# EAGLE design MotorDriver (EAGLE 5.12)

## Sheet 1 of 4
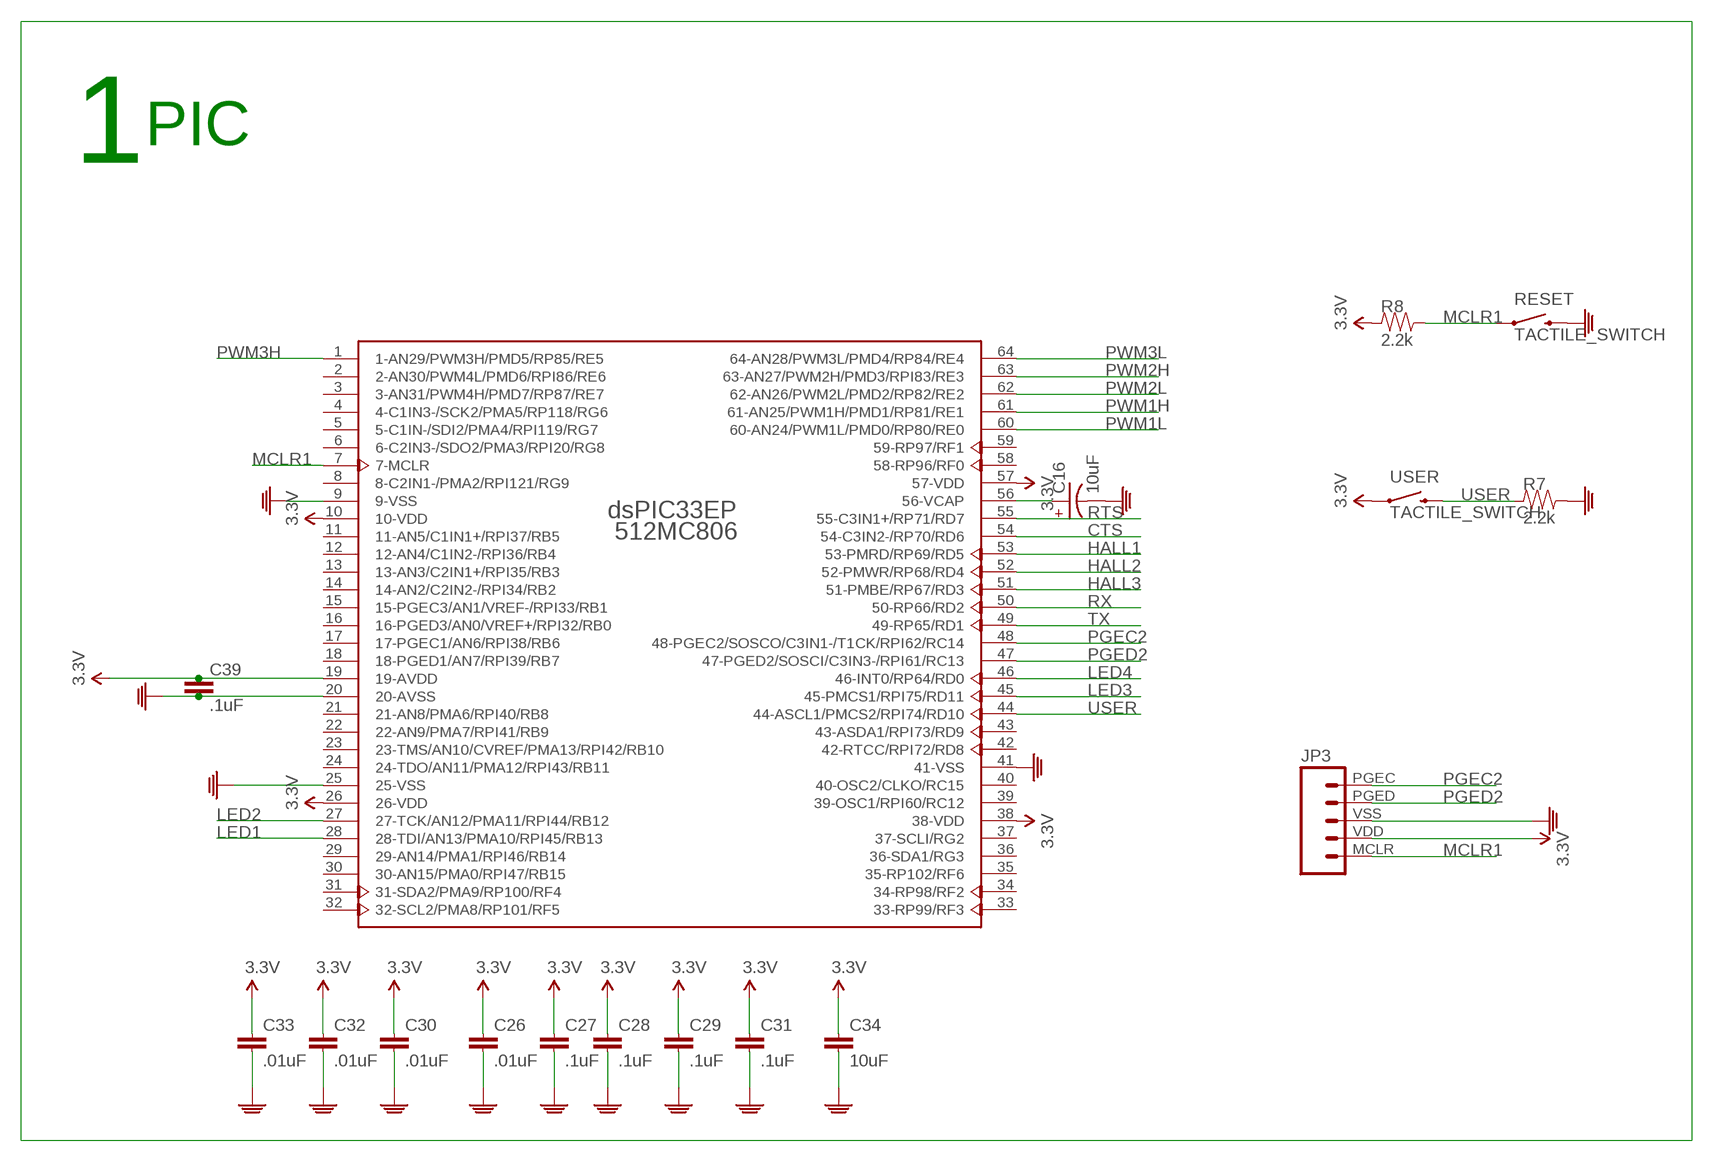
[diagram p0: schematic, sheet 1]

### Parts
C16  10uF  CAP-POL0603  [0603-POL]
C26  .01uF  CAP0603  [0603]
C27  .1uF  CAP0603  [0603]
C28  .1uF  CAP0603  [0603]
C29  .1uF  CAP0603  [0603]
C30  .01uF  CAP0603  [0603]
C31  .1uF  CAP0603  [0603]
C32  .01uF  CAP0603  [0603]
C33  .01uF  CAP0603  [0603]
C34  10uF  CAP1206  [1206]
C39  .1uF  CAP0603  [0603]
JP3  M05PICKIT3  [1X05-PICKIT3]
R7  2.2k  R0603  [0603]
R8  2.2k  R0603  [0603]
RESET  TACTILE_SWITCH  [TACTILE_SWITCH]
U$2  DSPIC33EP512MC806  [TQFP64_10X10]
USER  TACTILE_SWITCH  [TACTILE_SWITCH]

### Nets
3.3V: C26.1 C27.1 C28.1 C29.1 C30.1 C31.1 C32.1 C33.1 C34.1 C39.1 JP3.VDD R8.1 U$2.10(10-VDD) U$2.19(19-AVDD) U$2.26(26-VDD) U$2.38(38-VDD) U$2.57(57-VDD) USER.1 ; also sheet 2,3,4
CTS: U$2.54(54-C3IN2-/RP70/RD6) ; also sheet 4
GND: C16.- C26.2 C27.2 C28.2 C29.2 C30.2 C31.2 C32.2 C33.2 C34.2 C39.2 JP3.VSS R7.2 RESET.2 U$2.9(9-VSS) U$2.20(20-AVSS) U$2.25(25-VSS) U$2.41(41-VSS) ; also sheet 2,3,4
HALL1: U$2.53(53-PMRD/RP69/RD5) ; also sheet 4
HALL2: U$2.52(52-PMWR/RP68/RD4) ; also sheet 4
HALL3: U$2.51(51-PMBE/RP67/RD3) ; also sheet 4
LED1: U$2.28(28-TDI/AN13/PMA10/RPI45/RB13) ; also sheet 4
LED2: U$2.27(27-TCK/AN12/PMA11/RPI44/RB12) ; also sheet 4
LED3: U$2.45(45-PMCS1/RPI75/RD11) ; also sheet 4
LED4: U$2.46(46-INT0/RP64/RD0) ; also sheet 4
MCLR1: JP3.MCLR R8.2 RESET.1 U$2.7(7-MCLR)
N$15: C16.+ U$2.56(56-VCAP)
PGEC2: JP3.PGEC U$2.48(48-PGEC2/SOSCO/C3IN1-/T1CK/RPI62/RC14)
PGED2: JP3.PGED U$2.47(47-PGED2/SOSCI/C3IN3-/RPI61/RC13)
PWM1H: U$2.61(61-AN25/PWM1H/PMD1/RP81/RE1) ; also sheet 2
PWM1L: U$2.60(60-AN24/PWM1L/PMD0/RP80/RE0) ; also sheet 2
PWM2H: U$2.63(63-AN27/PWM2H/PMD3/RPI83/RE3) ; also sheet 2
PWM2L: U$2.62(62-AN26/PWM2L/PMD2/RP82/RE2) ; also sheet 2
PWM3H: U$2.1(1-AN29/PWM3H/PMD5/RP85/RE5) ; also sheet 2
PWM3L: U$2.64(64-AN28/PWM3L/PMD4/RP84/RE4) ; also sheet 2
RTS: U$2.55(55-C3IN1+/RP71/RD7) ; also sheet 4
RX: U$2.50(50-RP66/RD2) ; also sheet 4
TX: U$2.49(49-RP65/RD1) ; also sheet 4
USER: R7.1 U$2.44(44-ASCL1/PMCS2/RPI74/RD10) USER.2
Unconnected: U$2.2(2-AN30/PWM4L/PMD6/RPI86/RE6) U$2.3(3-AN31/PWM4H/PMD7/RP87/RE7) U$2.4(4-C1IN3-/SCK2/PMA5/RP118/RG6) U$2.5(5-C1IN-/SDI2/PMA4/RPI119/RG7) U$2.6(6-C2IN3-/SDO2/PMA3/RPI20/RG8) U$2.8(8-C2IN1-/PMA2/RPI121/RG9) U$2.11(11-AN5/C1IN1+/RPI37/RB5) U$2.12(12-AN4/C1IN2-/RPI36/RB4) U$2.13(13-AN3/C2IN1+/RPI35/RB3) U$2.14(14-AN2/C2IN2-/RPI34/RB2) U$2.15(15-PGEC3/AN1/VREF-/RPI33/RB1) U$2.16(16-PGED3/AN0/VREF+/RPI32/RB0) U$2.17(17-PGEC1/AN6/RPI38/RB6) U$2.18(18-PGED1/AN7/RPI39/RB7) U$2.21(21-AN8/PMA6/RPI40/RB8) U$2.22(22-AN9/PMA7/RPI41/RB9) U$2.23(23-TMS/AN10/CVREF/PMA13/RPI42/RB10) U$2.24(24-TDO/AN11/PMA12/RPI43/RB11) U$2.29(29-AN14/PMA1/RPI46/RB14) U$2.30(30-AN15/PMA0/RPI47/RB15) U$2.31(31-SDA2/PMA9/RP100/RF4) U$2.32(32-SCL2/PMA8/RP101/RF5) U$2.33(33-RP99/RF3) U$2.34(34-RP98/RF2) U$2.35(35-RP102/RF6) U$2.36(36-SDA1/RG3) U$2.37(37-SCLI/RG2) U$2.39(39-OSC1/RPI60/RC12) U$2.40(40-OSC2/CLKO/RC15) U$2.42(42-RTCC/RPI72/RD8) U$2.43(43-ASDA1/RPI73/RD9) U$2.58(58-RP96/RF0) U$2.59(59-RP97/RF1)

### Notes on the sheet
- 1 | PIC

## Sheet 2 of 4
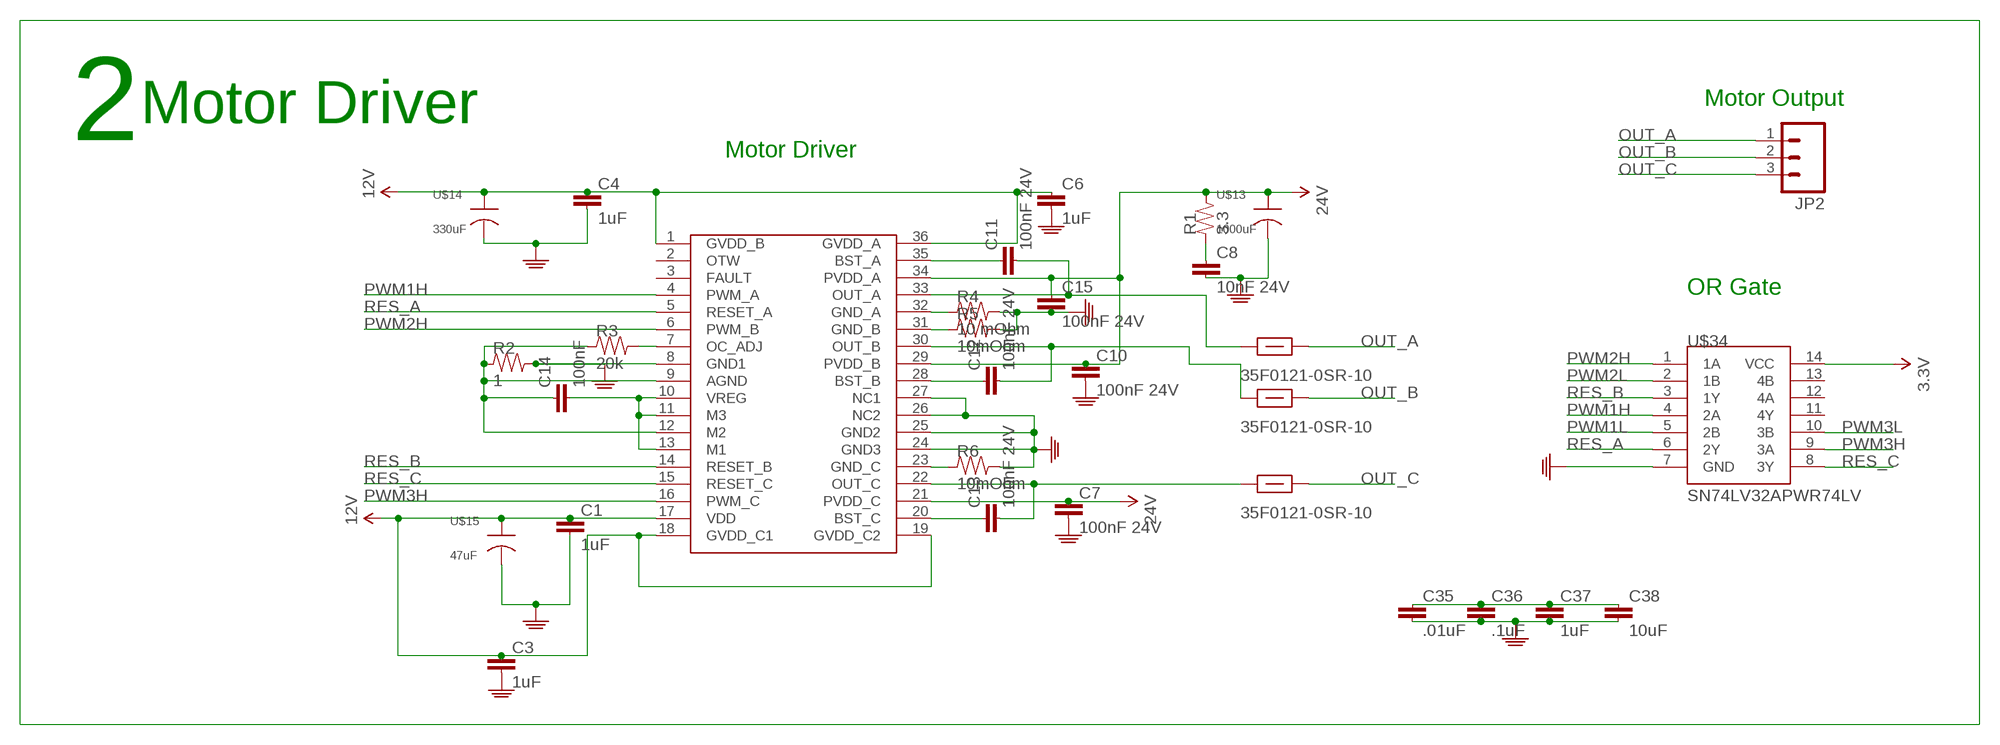
[diagram p1: schematic, sheet 2]

### Parts
C1  1uF  CAP0603  [0603]
C3  1uF  CAP0603  [0603]
C4  1uF  CAP0603  [0603]
C6  1uF  CAP0603  [0603]
C7  100nF 24V  CAP0603  [0603]
C8  10nF 24V  CAP0603  [0603]
C10  100nF 24V  CAP0603  [0603]
C11  100nF 24V  CAP0603  [0603]
C12  100nF 24V  CAP0603  [0603]
C13  100nF 24V  CAP0603  [0603]
C14  100nF  CAP0603  [0603]
C15  100nF 24V  CAP0603  [0603]
C35  .01uF  CAP0603  [0603]
C36  .1uF  CAP0603  [0603]
C37  1uF  CAP1206  [1206]
C38  10uF  CAP1206  [1206]
JP2  M03MINIFITJR  [MOLEX-3-MINIFITJR-RA]
R1  3.3  R0603  [0603]
R2  1  R0603  [0603]
R3  20k  R0603  [0603]
R4  10 mOhm  R0603  [0603]
R5  10mOhm  R0603  [0603]
R6  10mOhm  R0603  [0603]
U$1  DRV833236HSSOP  [36HSSOP]
U$10  35F0121-0SR-10  [2-SMD(J-LEAD)]
U$11  35F0121-0SR-10  [2-SMD(J-LEAD)]
U$12  35F0121-0SR-10  [2-SMD(J-LEAD)]
U$13  1000uF  CAP-RAD  [RADIAL-10]
U$14  330uF  CAP-RAD  [RADIAL-10]
U$15  47uF  CAP-RAD2  [RADIAL-5]
U$34  SN74LV32APWR74LV  [14TSSOP]

### Nets
3.3V: U$34.14(VCC) ; also sheet 1,3,4
12V: C1.1 C3.1 C4.1 C6.1 U$1.1(GVDD_B) U$1.17(VDD) U$1.18(GVDD_C1) U$1.19(GVDD_C2) U$1.36(GVDD_A) U$14.P$2 U$15.P$2 ; also sheet 3
24V: C7.1 C10.1 C15.1 C35.1 C36.1 C37.1 C38.1 R1.2 U$1.21(PVDD_C) U$1.29(PVDD_B) U$1.34(PVDD_A) U$13.P$2 ; also sheet 3
GND: C1.2 C3.2 C4.2 C6.2 C7.2 C8.2 C10.2 C15.2 C35.2 C36.2 C37.2 C38.2 R2.2 R4.2 R5.2 R6.2 U$1.8(GND1) U$1.24(GND3) U$1.25(GND2) U$1.26(NC2) U$1.27(NC1) U$13.P$1 U$14.P$1 U$15.P$1 U$34.7(GND) ; also sheet 1,3,4
M2: C14.1 R2.1 R3.1 U$1.9(AGND) U$1.12(M2)
N$3: R6.1 U$1.23(GND_C)
N$4: C12.2 U$1.30(OUT_B) U$11.P$1
N$5: C8.1 R1.1
N$6: C12.1 U$1.28(BST_B)
N$8: C11.1 U$1.35(BST_A)
N$9: C13.2 U$1.22(OUT_C) U$12.P$1
N$10: C13.1 U$1.20(BST_C)
N$11: C11.2 U$1.33(OUT_A) U$10.P$1
N$12: R3.2 U$1.7(OC_ADJ)
N$13: R4.1 U$1.32(GND_A)
N$14: R5.1 U$1.31(GND_B)
OUT_A: JP2.1 U$10.P$2
OUT_B: JP2.2 U$11.P$2
OUT_C: JP2.3 U$12.P$2
PWM1H: U$1.4(PWM_A) U$34.4(2A) ; also sheet 1
PWM1L: U$34.5(2B) ; also sheet 1
PWM2H: U$1.6(PWM_B) U$34.1(1A) ; also sheet 1
PWM2L: U$34.2(1B) ; also sheet 1
PWM3H: U$1.16(PWM_C) U$34.9(3A) ; also sheet 1
PWM3L: U$34.10(3B) ; also sheet 1
RES_A: U$1.5(RESET_A) U$34.6(2Y)
RES_B: U$1.14(RESET_B) U$34.3(1Y)
RES_C: U$1.15(RESET_C) U$34.8(3Y)
VREG: C14.2 U$1.10(VREG) U$1.11(M3) U$1.13(M1)
Unconnected: U$1.2(OTW) U$1.3(FAULT) U$34.11(4Y) U$34.12(4A) U$34.13(4B)

### Notes on the sheet
- Motor Output
- 2 | Motor Driver
- Motor Driver
- OR Gate

## Sheet 3 of 4
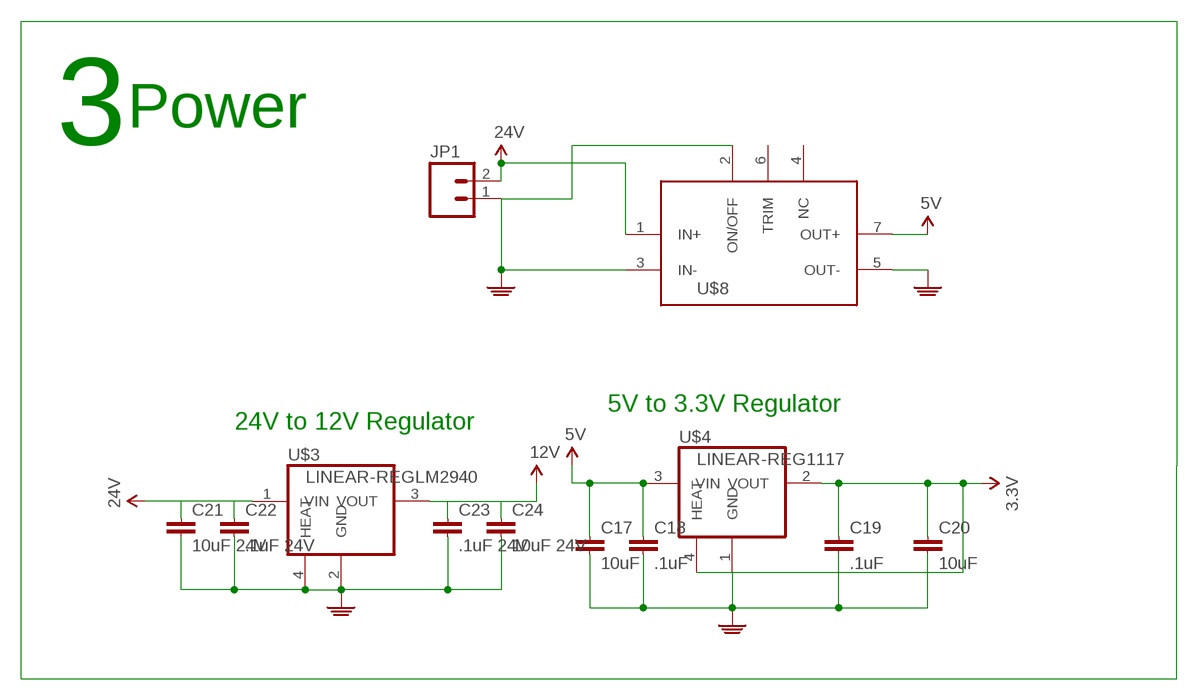
[diagram p2: schematic, sheet 3]

### Parts
C17  10uF  CAP1206  [1206]
C18  .1uF  CAP0603  [0603]
C19  .1uF  CAP0603  [0603]
C20  10uF  CAP1206  [1206]
C21  10uF 24V  CAP1206  [1206]
C22  .1uF 24V  CAP0603  [0603]
C23  .1uF 24V  CAP0603  [0603]
C24  10uF 24V  CAP1206  [1206]
JP1  M02MINI-MATENLOK-2  [TE-MINIMATENLOK-2]
U$3  LINEAR-REGLM2940  LINEAR-REGLM2937  [SOT223]
U$4  LINEAR-REG1117  [SOT223]
U$8  DC-DC-CONVERTER1.2A  [CC6-2405SF-E]

### Nets
3.3V: C19.1 C20.1 U$4.2(VOUT) U$4.4(HEAT) ; also sheet 1,2,4
5V: C17.1 C18.1 U$4.3(VIN) U$8.7(OUT+) ; also sheet 4
12V: C23.1 C24.1 U$3.3(VOUT) ; also sheet 2
24V: C21.1 C22.1 JP1.2 U$3.1(VIN) U$8.1(IN+) ; also sheet 2
GND: C17.2 C18.2 C19.2 C20.2 C21.2 C22.2 C23.2 C24.2 JP1.1 U$3.2(GND) U$3.4(HEAT) U$4.1(GND) U$8.2(ON/OFF) U$8.3(IN-) U$8.5(OUT-) ; also sheet 1,2,4
Unconnected: U$8.4(NC) U$8.6(TRIM)

### Notes on the sheet
- 3 | Power
- 5V to 3.3V Regulator
- 24V to 12V Regulator

## Sheet 4 of 4
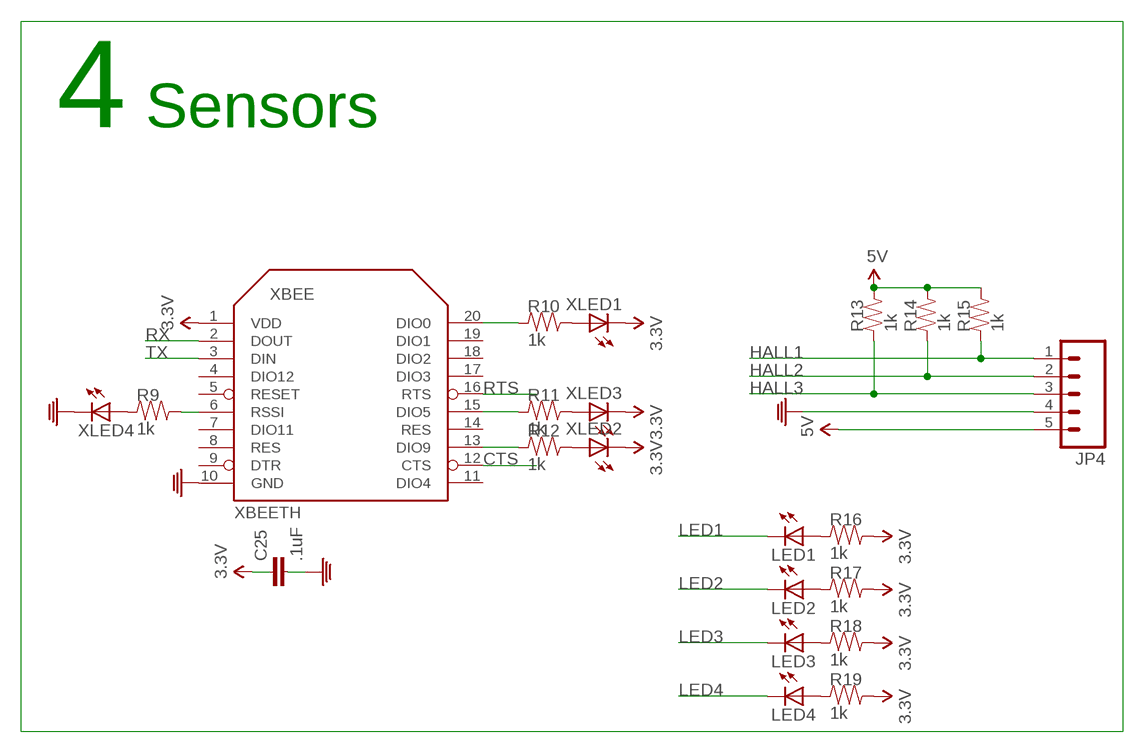
[diagram p3: schematic, sheet 4]

### Parts
C25  .1uF  CAP0603  [0603]
JP4  M05JST-SH  [JST-5-SH]
LED1  LED5MM  [LED5MM]
LED2  LED5MM  [LED5MM]
LED3  LED5MM  [LED5MM]
LED4  LED5MM  [LED5MM]
R9  1k  R0603  [0603]
R10  1k  R0603  [0603]
R11  1k  R0603  [0603]
R12  1k  R0603  [0603]
R13  1k  R0402  [0402]
R14  1k  R0402  [0402]
R15  1k  R0402  [0402]
R16  1k  R0603  [0603]
R17  1k  R0603  [0603]
R18  1k  R0603  [0603]
R19  1k  R0603  [0603]
XBEE  XBEETH  [XBEE-SILK]
XLED1  LED0603  [0603-DIODE]
XLED2  LED0603  [0603-DIODE]
XLED3  LED0603  [0603-DIODE]
XLED4  LED0603  [0603-DIODE]

### Nets
3.3V: C25.1 R16.2 R17.2 R18.2 R19.2 XBEE.1(VDD) XLED1.CAT(C) XLED2.CAT(C) XLED3.CAT(C) ; also sheet 1,2,3
5V: JP4.5 R13.2 R14.2 R15.2 ; also sheet 3
CTS: XBEE.12(CTS) ; also sheet 1
GND: C25.2 JP4.4 XBEE.10(GND) XLED4.CAT(C) ; also sheet 1,2,3
HALL1: JP4.1 R15.1 ; also sheet 1
HALL2: JP4.2 R14.1 ; also sheet 1
HALL3: JP4.3 R13.1 ; also sheet 1
LED1: LED1.K(C) ; also sheet 1
LED2: LED2.K(C) ; also sheet 1
LED3: LED3.K(C) ; also sheet 1
LED4: LED4.K(C) ; also sheet 1
N$20: R9.1 XLED4.AN(A)
N$21: R10.2 XLED1.AN(A)
N$22: R11.2 XLED3.AN(A)
N$23: R12.2 XLED2.AN(A)
N$24: R9.2 XBEE.6(RSSI)
N$25: R10.1 XBEE.20(DIO0)
N$26: R11.1 XBEE.15(DIO5)
N$27: R12.1 XBEE.13(DIO9)
N$29: LED1.A R16.1
N$31: LED2.A R17.1
N$32: LED3.A R18.1
N$33: LED4.A R19.1
RTS: XBEE.16(RTS) ; also sheet 1
RX: XBEE.2(DOUT) ; also sheet 1
TX: XBEE.3(DIN) ; also sheet 1
Unconnected: XBEE.4(DIO12) XBEE.5(RESET) XBEE.7(DIO11) XBEE.8(RES) XBEE.9(DTR) XBEE.11(DIO4) XBEE.14(RES) XBEE.17(DIO3) XBEE.18(DIO2) XBEE.19(DIO1)

### Notes on the sheet
- 4 | Sensors

## Library data of the parts
C1 C3 C4 C6-C8 C10-C15 C17-C39 = GibbotV5:CAP: Capacitor Standard 0603 ceramic capacitor, and 0.1" leaded capacitor.
C16 = GibbotV5:CAP-POL: CAPACITOR, American symbol
JP1 = GibbotV5:M02: Header 2 Standard 2-pin 0.1" header. Use with straight break away headers (SKU : PRT-00116), right angle break away headers (PRT-00553), swiss pins (PRT-00743), machine pins (PRT-00117), and female headers (PRT-00115). Molex polarized connector foot print use with SKU : PRT-08233 with associated crimp pins and housings.
JP2 = GibbotV5:M03: Header 3 Standard 3-pin 0.1" header. Use with straight break away headers (SKU : PRT-00116), right angle break away headers (PRT-00553), swiss pins (PRT-00743), machine pins (PRT-00117), and female headers (PRT-00115). Molex polarized connector foot print use with SKU : PRT-08232 with associated crimp pins and housings.
JP3 JP4 = GibbotV5:M05: Header 5 Standard 5-pin 0.1" header. Use with straight break away headers (SKU : PRT-00116), right angle break away headers (PRT-00553), swiss pins (PRT-00743), machine pins (PRT-00117), and female headers (PRT-00115). Molex polarized connector foot print use with SKU : PRT-08230 with associated crimp pins and housings.
LED1-LED4 XLED1-XLED4 = GibbotV5:LED: LEDs Standard schematic elements and footprints for 5mm, 3mm, 1206, and 0603 sized LEDs. 5mm - Spark Fun Electronics SKU : COM-00529 (and others)
R1-R19 = GibbotV5:R: RESISTOR, American symbol
RESET USER = GibbotV5:TACTILE_SWITCH
U$1 = motordriver:DRV8332
U$2 = GibbotV5:DSPIC33EP512MC806
U$3 U$4 = GibbotV5:LINEAR-REG
U$8 = GibbotV5:DC-DC-CONVERTER
U$10-U$12 = motordriver:35F0121-0SR-10
U$13 U$14 = motordriver:CAP-RAD
U$15 = motordriver:CAP-RAD2
U$34 = motordriver:SN74LV32APWR
XBEE = GibbotV5:XBEE

## Board
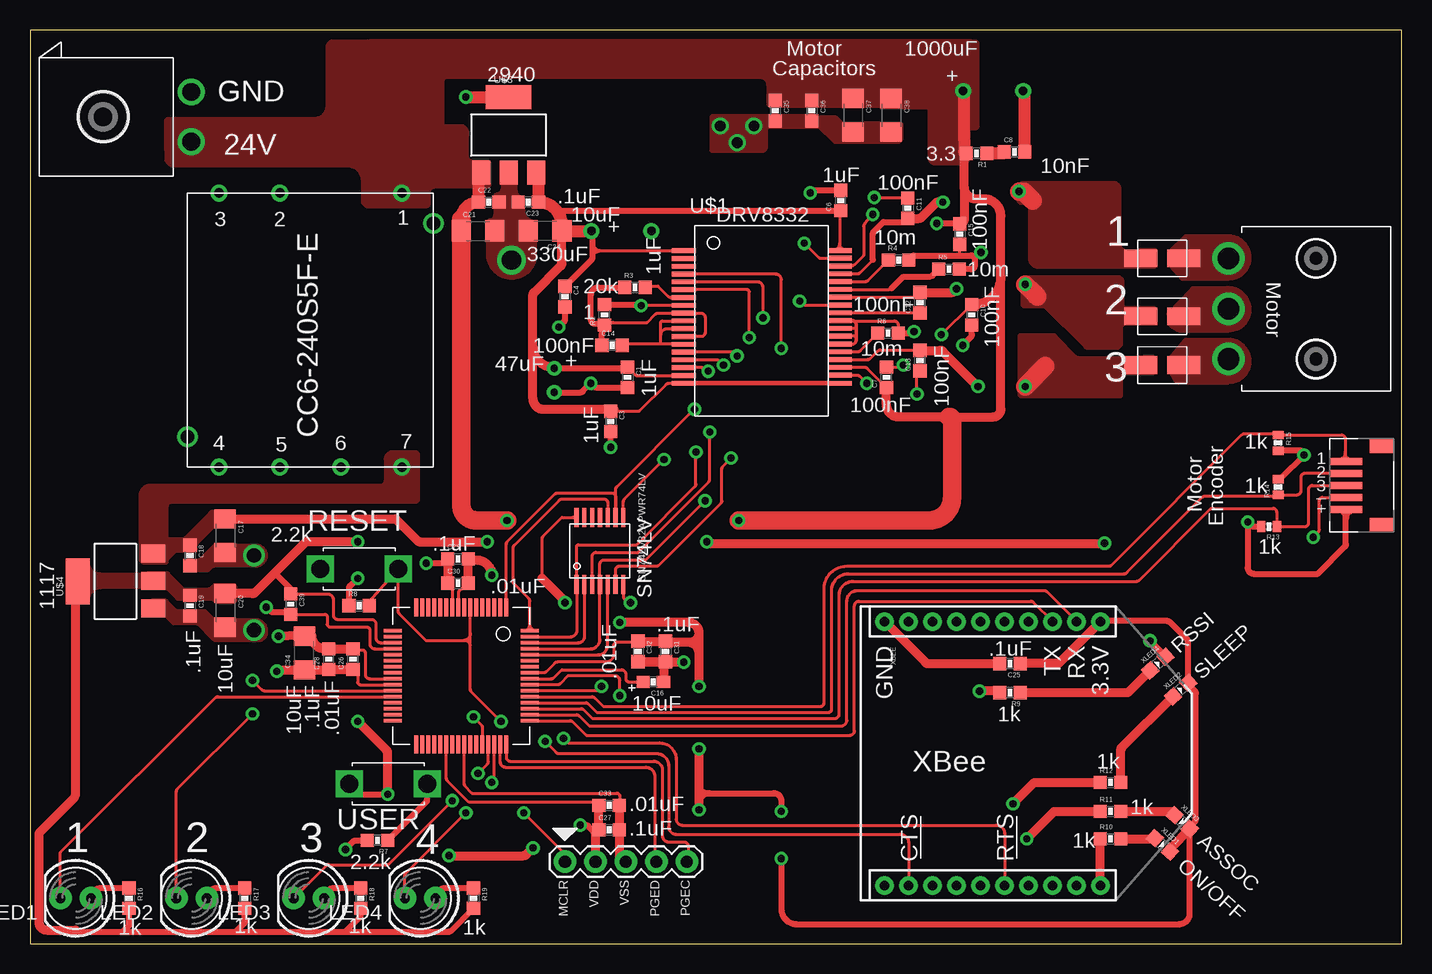
[diagram p4: board, top side]
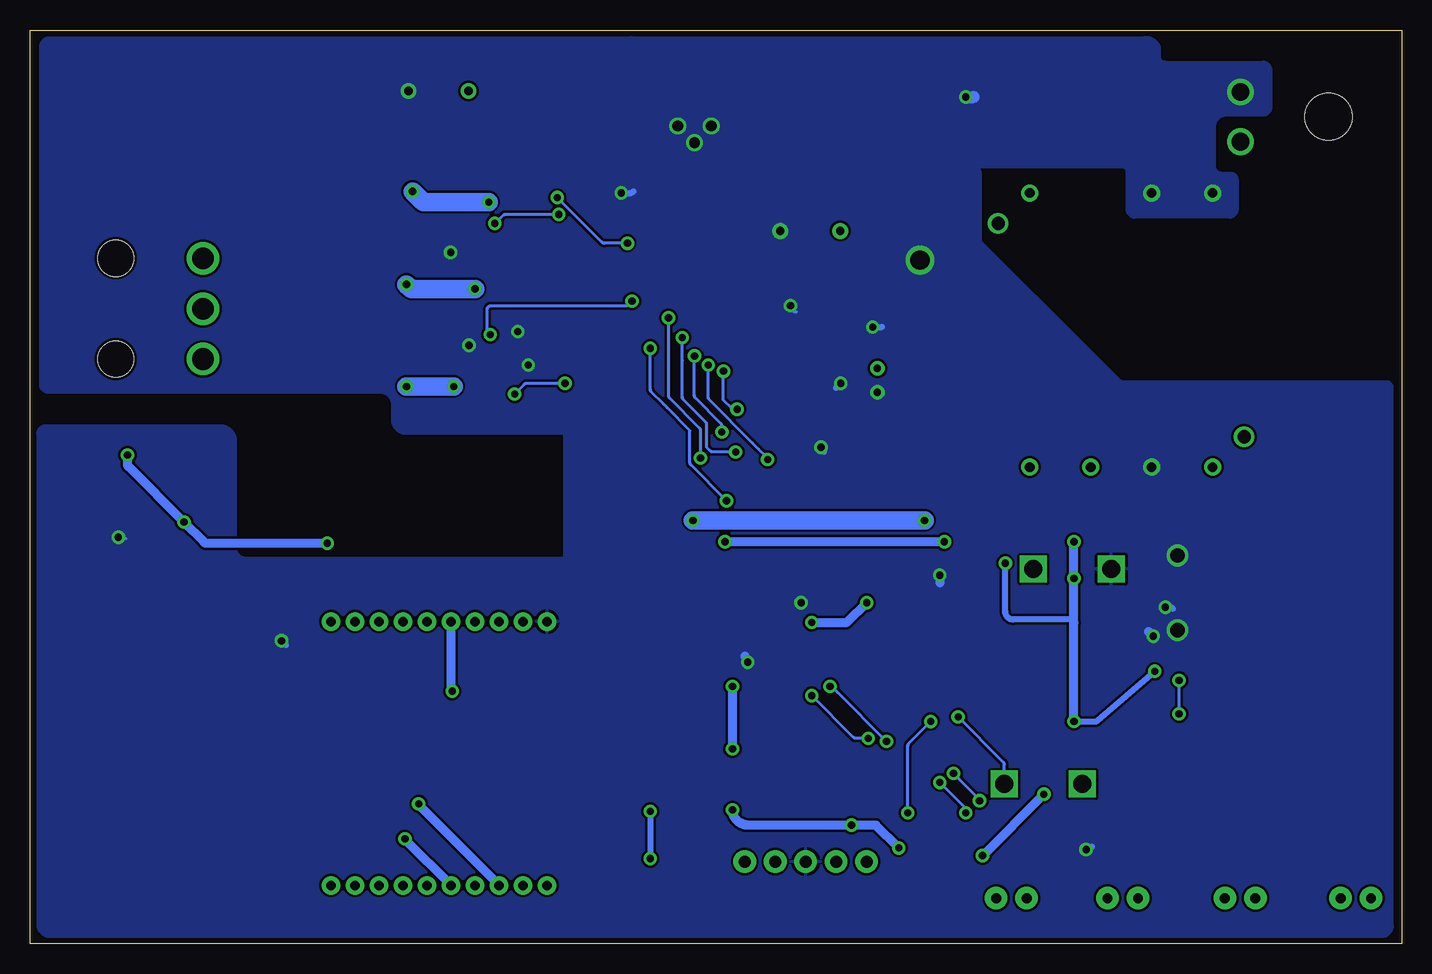
[diagram p5: board, bottom side, seen from below]

Size 114.3 x 76.2 mm. Coordinates in mm from the lower left corner, seen from the top.
Outline: 0,0 114.3,0 114.3,76.2 0,76.2 0,0
Copper layers (1*16): Top 0.035mm / dielectric 1.5mm / Bottom 0.035mm
Design rules "default *": minimum track width 8mil, minimum drill 20mil, track to track 8mil, track to pad 8mil, pad to pad 5mil, via to via 8mil, smd to smd 5mil, copper to edge 10mil, drill to drill 8mil, minimum pad ring 12mil, minimum via ring 10mil, stop-mask expansion 4mil, vias tented up to drill 0mil, thermal gap 10mil

### Footprints (pad centres in the part's own frame; a part is rotated, then mirrored left to right if it is on the bottom)
0603 = smd 1.1 x 1.1: 1 -0.85,0; 2 0.85,0
0603-POL = smd 1.1 x 1: + 0.85,0; - -0.85,0
1206 = smd 1.6 x 1.8: 1 -1.4,0; 2 1.4,0
TE-MINIMATENLOK-2 = drill 1.48 round: 1 -2.07,12.67; 2 2.07,12.67 | hole 3.91: 0,5.33
MOLEX-3-MINIFITJR-RA = drill 1.803 round: 1 4.191,13.538; 2 0,13.538; 3 -4.191,13.538 | hole 3: -4.204,6.248; 4.204,6.248
1X05-PICKIT3 = drill 1.016 pad 1.88 round: MCLR 1.27,-1.016; PGEC 11.43,-1.016; PGED 8.89,-1.016; VDD 3.81,-1.016; VSS 6.35,-1.016
JST-5-SH = smd 0.6 x 2.7: 1 2,4; 2 1,4; 3 0,4; 4 -1,4; 5 -2,4 | smd 1.2 x 2: P$6 -3.3,1; P$7 3.3,1
LED5MM = drill 0.813 pad 1.88 round: A -1.27,0; K 1.27,0
0402 = smd 0.7 x 0.9: 1 -0.65,0; 2 0.65,0
TACTILE_SWITCH = drill 1.5 square: 1 -3.25,0; 2 3.25,0
36HSSOP = smd 2 x 0.4: 1 -6.5,5.85; 2 -6.5,5.2; 3 -6.5,4.55; 4 -6.5,3.9; 5 -6.5,3.25; 6 -6.5,2.6; 7 -6.5,1.95; 8 -6.5,1.3; 9 -6.5,0.65; 10 -6.5,0; 11 -6.5,-0.65; 12 -6.5,-1.3; 13 -6.5,-1.95; 14 -6.5,-2.6; 15 -6.5,-3.25; 16 -6.5,-3.9; 17 -6.5,-4.55; 18 -6.5,-5.2; 19 6.5,-5.2; 20 6.5,-4.52; 21 6.5,-3.87; 22 6.5,-3.22; 23 6.5,-2.57; 24 6.5,-1.92; 25 6.5,-1.27; 26 6.5,-0.62; 27 6.5,0.03; 28 6.5,0.68; 29 6.5,1.33; 30 6.5,1.98; 31 6.5,2.63; 32 6.5,3.28; 33 6.5,3.93; 34 6.5,4.58; 35 6.5,5.23; 36 6.5,5.85
TQFP64_10X10 = smd 1.5 x 0.3: 1 -5.7,3.75; 2 -5.7,3.25; 3 -5.7,2.75; 4 -5.7,2.25; 5 -5.7,1.75; 6 -5.7,1.25; 7 -5.7,0.75; 8 -5.7,0.25; 9 -5.7,-0.25; 10 -5.7,-0.75; 11 -5.7,-1.25; 12 -5.7,-1.75; 13 -5.7,-2.25; 14 -5.7,-2.75; 15 -5.7,-3.25; 16 -5.7,-3.75; 33 5.7,-3.75; 34 5.7,-3.25; 35 5.7,-2.75; 36 5.7,-2.25; 37 5.7,-1.75; 38 5.7,-1.25; 39 5.7,-0.75; 40 5.7,-0.25; 41 5.7,0.25; 42 5.7,0.75; 43 5.7,1.25; 44 5.7,1.75; 45 5.7,2.25; 46 5.7,2.75; 47 5.7,3.25; 48 5.7,3.75 | smd 0.3 x 1.5: 17 -3.75,-5.7; 18 -3.25,-5.7; 19 -2.75,-5.7; 20 -2.25,-5.7; 21 -1.75,-5.7; 22 -1.25,-5.7; 23 -0.75,-5.7; 24 -0.25,-5.7; 25 0.25,-5.7; 26 0.75,-5.7; 27 1.25,-5.7; 28 1.75,-5.7; 29 2.25,-5.7; 30 2.75,-5.7; 31 3.25,-5.7; 32 3.75,-5.7; 49 3.75,5.7; 50 3.25,5.7; 51 2.75,5.7; 52 2.25,5.7; 53 1.75,5.7; 54 1.25,5.7; 55 0.75,5.7; 56 0.25,5.7; 57 -0.25,5.7; 58 -0.75,5.7; 59 -1.25,5.7; 60 -1.75,5.7; 61 -2.25,5.7; 62 -2.75,5.7; 63 -3.25,5.7; 64 -3.75,5.7
SOT223 = smd 1.499 x 2.007: 1 -2.261,-3.15; 2 0.025,-3.15; 3 2.311,-3.15 | smd 3.81 x 2.007: 4 0,3.15
CC6-2405SF-E = drill 0.8 round: 1 -11.43,7.62; 2 -11.43,-2.54; 3 -11.43,-7.62; 4 11.43,-7.62; 5 11.43,-2.54; 6 11.43,2.54; 7 11.43,7.62 | drill 1.1 round: P$9 8.89,-10.25; P$10 -8.89,10.25
2-SMD(J-LEAD) = smd 2.77 x 1.47: P$1 -1.79,0; P$2 1.79,0
RADIAL-10 = drill 0.7 round: P$1 0,2.5; P$2 0,-2.5
RADIAL-5 = drill 0.6 round: P$1 0,1; P$2 0,-1
14TSSOP = smd 1.6 x 0.35: 1 -2.8,1.95; 2 -2.8,1.3; 3 -2.8,0.65; 4 -2.8,0; 5 -2.8,-0.65; 6 -2.8,-1.3; 7 -2.8,-1.95; 8 2.8,-1.95; 9 2.8,-1.3; 10 2.8,-0.65; 11 2.8,0; 12 2.8,0.65; 13 2.8,1.3; 14 2.8,1.95
XBEE-SILK = drill 0.8 pad 1.524 round: 1 -11,20; 2 -11,18; 3 -11,16; 4 -11,14; 5 -11,12; 6 -11,10; 7 -11,8; 8 -11,6; 9 -11,4; 10 -11,2; 11 11,2; 12 11,4; 13 11,6; 14 11,8; 15 11,10; 16 11,12; 17 11,14; 18 11,16; 19 11,18; 20 11,20
0603-DIODE = smd 1.1 x 1.1: AN -0.85,0; CAT 0.85,0

### Placement (x,y rotation side)
C1  49.78,47.24 270 top
C3  48.39,43.56 270 top
C4  44.58,53.98 270 top
C6  67.56,61.98 90 top
C7  71.37,47.24 90 top
C8  82.04,66.04 0 top
C10  78.49,52.45 270 top
C11  73.15,61.34 270 top
C12  74.17,53.47 90 top
C13  74.17,48.64 90 top
C14  48.51,49.91 0 top
C15  77.47,59.18 270 top
C16  51.94,21.84 180 top
C17  16.26,34.04 270 top
C18  13.34,32.38 270 top
C19  13.34,28.19 270 top
C20  16.26,27.81 270 top
C21  37.34,59.44 0 top
C22  38.23,61.85 0 top
C23  41.53,61.85 180 top
C24  42.93,59.44 180 top
C25  81.66,23.37 180 top
C26  26.92,23.75 90 top
C27  48.26,9.53 0 top
C28  24.89,23.75 90 top
C29  35.66,32.11 0 top
C30  35.66,30.07 0 top
C31  52.96,24.38 270 top
C32  50.67,24.38 270 top
C33  48.26,11.56 0 top
C34  22.86,24.26 90 top
C35  62.1,69.47 270 top
C36  65.15,69.47 270 top
C37  68.58,69.09 270 top
C38  71.75,69.09 270 top
C39  21.72,28.32 270 top
JP1  0.76,68.96 270 top
JP2  113.41,52.96 90 top
JP3  43.31,7.87 0 top
JP4  113.67,38.23 90 top
LED1  3.81,3.81 180 top
LED2  13.46,3.81 180 top
LED3  23.24,3.81 180 top
LED4  32.51,3.81 180 top
R1  78.87,65.91 180 top
R2  47.88,52.45 90 top
R3  50.42,54.74 0 top
R4  72.39,57.02 0 top
R5  76.58,56.26 0 top
R6  71.5,50.93 0 top
R7  28.96,8.64 180 top
R8  27.43,28.19 0 top
R9  81.66,20.95 180 top
R10  90.04,8.76 0 top
R11  90.04,11.05 0 top
R12  90.04,13.46 0 top
R13  103.25,34.8 180 top
R14  104.01,38.1 90 top
R15  104.01,41.78 270 top
R16  8.26,3.81 270 top
R17  17.91,3.81 270 top
R18  27.56,3.81 270 top
R19  36.96,3.81 270 top
RESET  27.43,31.24 180 top
U$1  60.96,51.94 0 top
U$2  35.94,22.35 270 top
U$3  39.88,67.44 0 top
U$4  7.11,30.23 90 top
U$8  23.37,51.18 270 top
U$10  94.36,57.15 0 top
U$11  94.36,52.32 0 top
U$12  94.36,48.26 0 top
U$13  80.26,71.12 270 top
U$14  49.28,59.44 270 top
U$15  43.69,46.99 180 top
U$34  47.5,32.77 90 top
USER  29.84,13.34 0 top
XBEE  69.22,15.88 270 top
XLED1  94.36,8.26 318 top
XLED2  95.89,21.21 42 top
XLED3  96.01,10.16 318 top
XLED4  93.98,23.37 42 top

### Tracks (layer width: path | path; a pad name or v marks a point on that pad's centre or on a via)
3.3V  (via drill 0.6)
  Top 0.254: U$2.38 34.69,13.83 arc45 34.78,13.6 36.58,11.81 47.02,11.81 arc-45 47.25,11.72 C33.1 | U$2.10 35.19,30.12 arc45 35.1,30.35 C30.1 | 42.67,30.48 42.67,33.78 arc-45 42.77,34 44.32,35.56 45.23,35.56 arc-90 45.54,35.17 U$34.14 arc-90 U$34.14 | U$34.14 arc-45 45.53,35.56 | 45.26,35.56 arc90 45.53,36.03 45.53,35.58 arc90 U$34.14 | 3.84,1.11 arc-45 4.07,1.02 | U$2.57 42.79,22.6 arc45 43.02,22.7 43.72,23.4 arc-45 43.95,23.5 48.01,23.5 arc90 48.64,24.13 48.64,24.89 arc-90 48.9,25.15 50.55,25.15 | 50.55,25.15 50.59,25.15 arc90 C32.1 | 50.55,25.15 arc90 50.67,25.27 52.83,25.27 arc-90 52.96,25.15 | U$2.26 27.55,21.6 arc-90 27.3,21.84 27.3,22.52 arc90 C26.1 | U$2.19 29.25,25.1 arc-90 28.83,25.53 28.83,26.67 arc90 28.45,27.05 25.65,27.05 arc-90 25.27,27.43 25.27,28.7 arc90 24.8,29.17 C39.1 arc90 21.93,28.96
  Top 0.406: 3.72,12.23 arc90 3.81,12.32 3.81,12.45
  Top 0.508: R19.2 35.11,1.11 arc-45 34.88,1.02 26.29,1.02 | 7.75,1.02 17.14,1.02 | 17.14,1.02 26.29,1.02 | R18.2 27.56,2.42 arc-45 27.47,2.19 26.29,1.02 | R17.2 17.91,1.91 arc-45 17.81,1.69 17.14,1.02 | R16.2 8.26,1.66 arc-45 8.16,1.43 7.75,1.02 | 4.07,1.02 7.75,1.02 | 3.81,1.14 3.84,1.11 | R8.1 26.58,29.62 arc-45 26.68,29.85 v27.3,30.48 | v62.61,7.11 62.61,2.92 arc90 63.88,1.65 95.76,1.65 arc90 96.64,2.54 XLED3.CAT 96.64,9.64 arc-45 96.74,9.87 97.06,10.19 arc45 97.16,10.42 97.16,20.88 arc45 97.06,21.1 96.64,21.52 arc45 96.55,21.74 XLED2.CAT 96.52,25.14 arc45 96.42,25.37 94.96,26.83 arc45 94.74,26.92 89.33,26.92 arc45 XBEE.1 | 47.12,9.23 46.54,9.81 arc45 46.31,9.91 v45.85,9.91 | v62.61,11.05 62.61,11.94 arc90 61.98,12.57 56.64,12.57 arc90 55.75,11.68 | 55.75,13.21 arc90 56.39,12.57 | v33.02,31.75 34.58,31.75 arc90 C29.1 | v29.81,12.48 27.58,12.48 arc-45 27.36,12.57 USER.1 | 21.93,28.96 21.93,29.24 arc45 21.84,29.47 20.38,30.92
  Top 0.762: JP3.VDD 47.12,9.23 arc-90 C27.1 C33.1 | XLED1.CAT 94.99,7.81 arc-45 95.09,8.03 XLED3.CAT | C25.1 85.58,23.37 arc45 85.8,23.46 XBEE.1 | C29.1 C30.1 | U$4.4 arc90 3.81,30.07 3.81,12.45 | C20.1 18.54,29.21 arc45 18.77,29.31 20.38,30.92 22.99,33.53 v27.3,33.53 | 55.75,24.26 v55.75,21.46 55.75,21.34 | 55.75,24.26 55.75,25.91 | 55.75,25.91 arc90 54.86,26.8 v49.15,26.8 | 3.72,12.23 0.85,9.36 arc45 0.76,9.14 0.76,1.78 arc90 1.4,1.14 3.81,1.14 | C26.1 C28.1 arc-90 24.85,22.86 C34.1 20.7,22.86 arc90 v20.57,22.73 | v55.75,11.18 55.75,11.68 55.75,13.21 v55.75,16.26 | v44.58,28.45 arc45 44.49,28.66 42.67,30.48 | v34.92,7.37 41.14,7.37 arc45 41.37,7.46 v41.91,8 | v27.3,18.55 29.72,16.13 arc-45 29.81,15.91 v29.81,12.48 | C32.1 C31.1 | 55.75,25.91 arc-90 54.99,25.15 | 52.96,25.15 54.86,25.15 arc-90 55.75,24.26
  Bottom 0.508: v33.02,31.75 33.02,27.69 arc-90 32.38,27.05 27.56,27.05 arc90 27.3,26.8 | v27.3,18.55 25.53,18.55 arc-45 25.3,18.64 v20.57,22.73 | v62.61,11.05 v62.61,7.11
  Bottom 0.762: v27.3,18.55 27.3,26.8 v27.3,30.48 v27.3,33.53 | v55.75,11.18 arc-90 54.48,9.91 v45.85,9.91 43.81,9.91 v41.91,8 | v55.75,16.26 v55.75,21.46 | v49.15,26.8 46.36,26.8 arc-45 46.13,26.89 v44.58,28.45 | v29.81,12.48 v34.92,7.37
  pour Top (no thermals): 3.56,31.88 4.83,31.88 arc90 5.84,30.86 9.4,30.86 10.79,30.86 arc-90 11.05,30.61 11.05,29.97 arc-90 10.79,29.72 5.97,29.72 arc90 4.83,28.57 3.43,28.57 arc90 3.3,28.45
  pour Top (no thermals): 10.29,30.99 11.3,30.99 arc-45 11.52,30.89 12.83,29.59 14.85,29.59 arc45 15.08,29.68 15.37,29.97 16.89,29.97 arc-90 17.14,29.72 17.14,28.7 arc-90 16.89,28.45 15.63,28.45 arc-45 15.4,28.54 15.24,28.7 12.45,28.7 arc-45 12.23,28.8 11.43,29.59 9.91,29.59 arc-90 9.78,29.72 9.78,30.86 arc-90 9.91,30.99
5V  (via drill 0.6)
  Top 0.508: R15.2 105.81,41.13 arc-90 v106.17,40.77 104.25,38.84 arc-45 104.02,38.75 R14.2 | R13.2 101.99,34.8 arc-45 101.76,34.89 v101.47,35.18 | v101.47,35.18 arc90 101.35,35.05 | v101.47,35.18 101.47,31.37 arc90 101.98,30.86 107.31,30.86 109.57,33.12 arc45 109.67,33.34 109.67,35.5 arc-90 110.36,36.2 109.09,36.2 | 109.09,36.2 108.97,36.2 | 109.09,36.2 arc-90 109.67,35.43 JP4.5 | JP4.5 arc-90 JP4.5
  Top 0.762: C17.1 30.47,35.44 32.29,33.62 arc45 32.51,33.53 v38.1,33.53 | v89.53,33.4 56.65,33.4 arc-45 56.42,33.49 v56.39,33.53
  Bottom 0.762: v106.17,40.77 106.17,40.01 arc-45 106.08,39.78 v101.47,35.18 99.79,33.49 arc-45 99.56,33.4 v89.53,33.4 | v38.1,33.53 v56.39,33.53
  pour Top (no thermals): 10.41,31.75 11.04,31.75 arc45 11.27,31.84 12.19,32.77 13.84,32.77 13.84,33.14 arc-45 13.94,33.37 15.37,34.8 16.89,34.8 arc90 17.02,34.92 17.02,35.94 arc90 16.89,36.07 15.37,36.07 15.24,36.07 arc45 15.02,35.98 12.83,33.78 11.18,33.78 arc45 10.96,33.69 10.29,33.02
  pour Top (no thermals): 30.86,41.02 30.23,41.02 arc90 29.59,40.39 29.59,38.61 arc-90 29.21,38.23 10.03,38.23 arc90 9.14,37.34 9.14,32.13 arc90 9.53,31.75 11.3,31.75 arc90 11.43,31.88 11.43,36.45 arc-90 11.81,36.83 32.13,36.83 arc90 32.38,37.08 32.38,40.77 arc90 32.13,41.02
12V
  Top 0.254: U$1.17 50.62,47.39 arc-45 50.39,47.49 C1.1 | U$1.18 53.22,46.74 arc45 53,46.65 50.85,44.5 arc-45 50.63,44.41 C3.1 48.46,44.48 arc-45 48.68,44.58 | C6.1 67.55,61.12 arc45 67.46,60.89 67.46,58.29 | 67.46,58.29 arc-90 66.79,57.84 68.1,57.84 | 68.1,57.84 68.28,57.84 | 68.1,57.84 arc-90 67.46,58.39 | 67.46,58.29 U$1.36 | 43.56,61.47 42.76,61.47 arc-90 C23.1 | 46.87,58.55 arc90 47.62,57.79 | U$1.1 47.55,57.79 arc90 46.77,57.02
  Top 0.381: U$1.18 U$1.19
  Top 0.508: C6.1 44.03,61.13 arc-45 43.81,61.22 43.56,61.47 | 46.87,59.44 46.87,58.55 46.87,57.24 arc-45 46.77,57.02 C4.1 | 43.6,48.09 43.68,48.02 | 43.68,48.02 49.6,48.02 arc45 C1.1 | 43.68,48.02 arc-45 U$15.P$2
  Top 0.762: 41.91,49.78 arc90 43.6,48.09 | 41.91,49.78 41.91,54.1 arc-45 42,54.32 44.23,56.55 arc45 44.33,56.78 C24.1 | 48.68,44.58 42.8,44.58 arc-90 41.91,45.47 41.91,49.78
  Top 1.016: U$3.3 arc-90 42.38,64.1 C23.1 arc-90 44.33,59.9 C24.1 U$14.P$2 46.87,59.44
24V  (via drill 0.6)
  Top 0.254: U$1.21 69.56,48.07 arc-45 69.79,47.98 C7.1 | U$1.29 64.59,53.27 arc-45 64.36,53.37 v64.14,53.59 | U$1.34 68.46,56.52 arc45 68.68,56.62 69.47,57.4 69.47,59.81 arc-45 69.56,60.04 v70.23,60.83 | C15.1 arc45 77.38,60.07 | C10.1 arc45 78.42,53.27 v75.95,50.8
  Top 0.508: 77.38,60.07 v75.56,60.07
  Top 0.762: C10.1 78.57,53.3 arc90 80.9,55.63 | C15.1 arc90 77.85,60.41 77.85,63.12 | C7.1 71.37,44.96 arc90 72.39,43.94 76.58,43.94 80.26,43.94 arc90 80.9,44.58 80.9,55.63 | 80.9,60.71 arc90 79.5,62.1 | 78.87,62.1 arc-90 77.85,63.12 | 77.85,63.12 77.85,67.06 | 78.87,62.1 arc-90 77.85,63.12 | 79.5,62.1 78.87,62.1 | 80.9,60.71 arc90 79.5,62.1 | 80.9,55.63 80.9,60.71
  Top 1.016: C21.1 35.94,60.41 arc-90 C22.1 37.38,64.05 arc-90 U$3.1 | R1.2 arc-90 77.85,66.08 77.85,67.06 77.85,71.12 arc90 77.72,71.25
  Top 1.524: 35.94,60.41 35.94,36.58 arc90 37.21,35.31 v39.75,35.31 | v59.05,35.31 74.93,35.31 arc90 76.83,37.21 76.83,43.69 arc90 76.58,43.94
  Bottom 0.254: v64.14,53.59 64.42,53.31 arc45 64.65,53.21 75.88,53.21 arc-90 76.2,52.9 76.2,51.19 arc-45 76.11,50.96 v75.95,50.8 | v70.23,60.83 74.67,60.83 arc-45 74.9,60.74 v75.56,60.07
  Bottom 1.524: v39.75,35.31 v59.05,35.31
  pour Top (no thermals): 36.07,68.2 12.06,68.2 arc90 11.3,67.44 11.3,65.53 arc90 11.94,64.9 26.42,64.9 arc-90 27.69,63.63 27.69,61.98 arc90 28.19,61.47 33.02,61.47 arc90 33.27,61.72 33.27,62.61 arc-90 33.78,63.12 38.1,63.12 arc90 38.35,63.37 38.35,65.02 arc90 38.1,65.28 36.83,65.28 arc-90 36.45,65.66 36.45,67.31 arc90
  pour Top (no thermals): 70.87,69.72 78.23,69.72 arc90 78.49,69.98 78.49,75.18 arc90 78.36,75.31 28.45,75.31 arc90 28.07,74.93 25.4,65.66 arc90 28.19,65.53 34.04,65.53 arc90 34.42,65.91 34.42,71.88 arc-90 34.8,72.26 60.83,72.26 arc-90 61.47,71.63 61.47,70.1 arc90 61.72,69.85 70.74,69.85 arc-90
  pour Top (no thermals): 11.3,66.29 11.3,68.58 arc-90 11.56,68.83 23.75,68.83 arc90 24.77,69.85 24.77,74.8 arc-90 25.27,75.31 32.26,75.31 arc-90 33.02,74.55 33.02,65.66 arc-90 32.26,64.9 11.94,64.9 arc-90 11.43,65.41
  pour Top (no thermals): 77.72,75.31 78.74,75.31 arc-90 78.99,75.06 78.99,68.2 arc-90 78.74,67.94 78.36,67.94 arc90 78.23,67.82 78.23,65.53 arc-90 77.72,65.02 75.44,65.02 arc-90 74.93,65.53 74.93,75.06 arc-90 75.18,75.31
CTS  (via drill 0.6)
  Top 0.254: v42.93,16.89 43.85,15.97 arc45 44.07,15.88 52.2,15.88 arc-90 53.21,14.86 53.21,9.78 arc90 53.85,9.14 72.52,9.14 arc-90 73.22,8.45 XBEE.12 | U$2.54 47.13,21.1 arc45 47.36,21.2 v47.62,21.46
  Bottom 0.254: v42.93,16.89 46.99,20.95 47.41,21.37 | 47.41,21.37 arc-45 v47.62,21.46 arc45 47.41,21.37
GND  (via drill 0.6, 0.9, 1.2, 1.6)
  Top 0.254: U$34.7 49.45,29.04 arc90 v50.04,28.45 | U$2.41 36.19,13.34 arc45 36.28,13.12 36.83,12.57 48.9,12.57 arc-90 49.15,12.32 49.15,11.6 arc-90 C33.2 | C7.2 72.35,48.09 arc45 72.57,48.19 v72.77,48.26 | 68.55,51.97 U$1.27 | U$1.26 arc90 67.47,51.31 68.71,51.31 arc-90 68.83,51.18 | U$1.24 68.56,50.02 arc90 68.83,50.29 | 68.83,50.55 arc90 68.71,50.67 U$1.25 | R6.2 72.35,51.6 arc90 72.01,51.94 68.58,51.94 arc-90 68.55,51.97 | 68.83,51.69 arc90 68.55,51.97 | R4.2 arc-90 73.62,57.4 | 77.47,57.4 C15.2 | JP4.4 107.71,37.23 arc90 107.44,36.96 107.44,34.55 arc-45 107.35,34.32 v106.93,33.91 | U$1.8 50.96,53.24 arc90 v50.93,53.21 arc90 50.84,53.3 | 27.01,24.51 arc-90 C26.2 arc90 27.01,24.51 | 78.42,57.4 78.99,57.4 | U$2.9 35.69,29.25 arc-45 35.78,29.47 C30.2 | U$2.25 28.32,22.1 arc-90 27.94,22.48 27.94,24.26 arc90 27.69,24.51 27.01,24.51 | U$2.20 28.74,24.6 arc-90 28.32,25.02 28.32,26.16 arc90 28.07,26.42 25.02,26.42 arc-90 24.77,26.67 24.77,27.3 arc90 24.6,27.47 C39.2 arc-90 21.93,27.69
  Top 0.305: 68.83,50.29 68.83,50.55 68.83,51.18 68.83,51.69
  Top 0.508: XLED4.CAT arc45 94.56,24.06 v93.34,25.27 | v48.39,41.4 C3.2 | C6.2 65.37,62.83 arc45 65.15,62.73 v65.02,62.61 | R6.2 73.53,50.93 arc90 v73.66,51.05 | R5.2 78.42,56.26 arc90 78.74,56.58 78.74,57.09 arc90 78.42,57.4 77.47,57.4 73.62,57.4 | 78.99,57.4 arc90 v79.25,57.66 | C10.2 78.49,50.8 arc-45 78.39,50.58 v77.72,49.91 | R7.2 27.18,8.64 arc45 26.96,8.54 v26.29,7.87 | R2.2 50.84,53.3 | 21.93,27.69 20.2,27.69 arc-45 19.97,27.78 v19.68,28.07 | C4.2 44.58,52.08 arc-45 44.48,51.85 v44.07,51.44 | U$15.P$1 45.86,45.99 arc45 46.08,46.08 v46.74,46.74 46.98,46.49 arc45 47.21,46.39 C1.2
  Top 0.762: C33.2 C27.2 49.11,7.41 arc90 JP3.VSS | C25.2 74.85,23.37 arc-45 74.63,23.46 XBEE.10 | 23.5,25.66 C34.2 | 23.5,25.66 arc-45 23.27,25.75 v20.7,25.65 | C30.2 C29.2 37.21,32 arc-90 v38.48,30.73 | C26.2 C28.2 24.55,24.6 arc-90 23.5,25.66 | C16.- 52.79,23.24 arc-45 52.89,23.46 C31.2 C32.2 arc45 50.77,23.5 v54.48,23.5
  Top 1.016: U$3.4 arc90 39.85,70.61 v36.32,70.61 | C8.2 82.89,70.86 arc45 82.8,71.08 U$13.P$1
  Bottom 0.254: v50.04,28.45 50.29,28.45 | v72.77,48.26 72.64,48.64 | v79.25,57.66 79.63,57.66 | v106.93,33.91 106.56,33.91 arc45 106.33,33.82 106.3,33.78 | v50.93,53.21 arc-90 50.42,52.7
  Bottom 0.508: v93.34,25.27 92.96,24.89 | v48.39,41.4 arc-45 48.3,41.19 48.13,41.02 | v65.02,62.61 64.27,62.61 arc-45 64.04,62.7 64.01,62.74 | v73.66,51.05 73.91,51.05 | v77.72,49.91 77.47,49.91 | v26.29,7.87 26.17,7.87 arc-45 25.94,7.97 25.78,8.13 | v19.68,28.07 19.31,28.07 arc45 19.08,27.97 19.05,27.94 | v44.07,51.44 43.31,51.44 | v46.74,46.74 47.12,46.35
  Bottom 0.762: v20.7,25.65 21.08,26.04 | v38.48,30.73 38.48,30.1 | v54.48,23.5 54.74,24
  Bottom 1.016: v36.32,70.61 35.69,70.61
  other vias: 57.53,68.2 58.93,66.8 60.33,68.2 40.13,57.02 18.67,32.38 18.67,26.16
  pour Bottom (no thermals): 19.68,73.53 11.56,73.53 arc90 10.92,72.9 10.92,69.72 arc90 11.56,69.09 14.61,69.09 arc-90 15.62,68.07 15.62,64.9 arc-90 14.99,64.26 14.22,64.26 arc90 13.72,63.75 13.72,61.21 arc90 14.35,60.58 22.23,60.58 arc90 22.86,61.21 22.86,64.39 arc-90 23.24,64.77 35.69,64.77 arc-90 36.07,64.39 36.07,56.13 arc90 36.96,55.24 42.04,55.24 arc-90 42.8,54.48 42.8,40.77 arc90 43.43,40.13 49.28,40.13 arc90 49.66,40.51 49.66,50.55 arc-90 50.55,51.44 52.58,51.44 arc90 53.21,52.07 53.21,60.58 arc-90 53.59,60.96 65.66,60.96 arc90 66.42,61.72 66.42,69.6 arc-90 66.67,69.85 88.77,69.85 arc90 89.66,70.74 89.66,75.18 arc90 89.28,75.56 21.46,75.56 arc90 20.19,74.68 20.19,73.91 arc-90
  pour Top (no thermals): 38.1,59.05 38.1,57.53 arc90 40.13,55.5 arc90 42.16,57.53 42.16,59.18 39.75,59.18
  pour Top (no thermals): 39.88,64.77 39.62,64.77 arc90 39.37,64.52 39.37,63.12 arc-90 38.73,62.48 38.73,60.83 arc-90 38.23,60.33 38.23,58.8 arc-90 38.1,58.67 42.16,58.67 42.16,60.2 arc-90 41.15,61.21 41.15,61.98 41.15,62.23 arc-90 40.51,62.87 40.51,63.5 40.51,64.26 arc90 40.01,64.77
  pour Top (no thermals): 56.9,69.09 64.64,69.09 arc-90 64.77,68.96 67.05,68.96 arc-45 67.28,68.87 67.69,68.45 72.52,68.45 arc-90 72.64,68.33 72.64,67.18 arc-90 72.26,66.8 67.19,66.8 arc-45 66.96,66.89 65.79,68.07 61.59,68.07 arc90 61.34,67.82 61.34,66.42 arc-90 60.96,66.04 56.9,66.04 arc-90 56.77,66.17 56.77,68.83 arc-90
  pour Bottom (no thermals): 63.5,65.28 63.5,42.8 arc90 63.75,42.55 82.93,42.55 arc90 84.07,43.69 84.07,44.96 arc-90 85.09,45.97 112.78,45.97 arc90 113.41,46.61 113.41,74.8 arc90 112.65,75.56 64.26,75.56 arc90 63.63,74.93
  pour Bottom (no thermals): 20.7,41.02 22.1,41.02 22.1,38.48 19.56,38.48 19.56,41.02 20.32,41.02
  pour Top (no thermals): 13.46,32 13.97,32 arc45 14.19,32.1 15.37,33.27 18.8,33.27 arc-90 19.68,32.38 arc-90 18.8,31.5 15.37,31.5 arc45 15.15,31.4 14.86,31.11 13.34,31.11
  pour Top (no thermals): 10.16,28.7 11.17,28.7 arc-45 11.4,28.61 12.19,27.81 14.47,27.81 arc-45 14.7,27.72 15.37,27.05 18.8,27.05 arc-90 19.68,26.16 19.68,25.91 arc-90 19.05,25.27 15.5,25.27 arc-45 15.27,25.37 13.97,26.67 12.07,26.67 arc-45 11.85,26.76 11.3,27.3 10.03,27.3
  pour Bottom: 112.39,43.18 113.03,43.18 arc-90 113.67,42.55 113.67,1.65 arc-90 112.65,0.64 1.65,0.64 arc-90 0.76,1.52 0.76,46.35 arc-90 1.27,46.86 22.35,46.86 arc-90 23.37,45.85 23.37,38.35 arc90 24.26,37.47 48.9,37.47 arc-90 50.42,35.94 50.42,30.1 arc90 52.7,27.81 64.39,27.81 arc90 65.15,28.57 65.15,30.73 arc-90 66.55,32.13 96.27,32.13 arc90 97.16,33.02 97.16,41.91 arc-90 98.42,43.18
  pour Bottom: 49.28,40.26 63.88,40.26 arc90 64.9,41.27 64.9,61.21 arc90 64.01,62.1 52.2,62.1 arc90 51.44,61.34 51.44,60.2 arc-90 50.93,59.69 49.02,59.69 arc90 48.64,59.31 48.64,40.51 arc90 48.77,40.39
  pour Bottom: 44.32,49.4 43.56,49.4 arc90 42.8,48.64 42.8,38.61 arc-90 41.91,37.72 35.69,37.72 arc90 34.54,36.58 34.54,32.51 arc90 35.81,31.24 48.39,31.24 arc-90 50.29,29.34 50.29,28.07 arc90 51.31,27.05 68.83,27.05 arc90 69.72,27.94 69.72,48.39 arc90 68.33,49.78
  pour Bottom: 29.46,37.59 33.91,37.59 arc90 35.05,38.73 35.05,64.01 arc-90 36.2,65.15 47.62,65.15 arc-90 48.26,64.52 48.26,38.48 arc-90 46.1,36.32 30.1,36.32 arc-90 29.46,36.96
  pour Bottom: 20.07,46.86 23.24,46.86 arc45 23.46,46.96 37.59,61.09 43.56,61.09 arc-90 44.7,59.94 44.7,33.53 arc-90 42.8,31.62 21.21,31.62 arc-90 19.68,33.15 19.68,46.35 arc-90 19.94,46.61
HALL1
  Top 0.254: U$2.53 46.83,20.6 arc-45 47.05,20.51 47.75,19.81 65.91,19.81 arc90 66.17,20.07 66.17,29.59 arc-90 68.07,31.5 89.91,31.5 arc45 90.14,31.59 101,42.45 arc-45 101.22,42.55 104.28,42.55 arc-45 104.5,42.45 104.52,42.43 | 104.52,42.43 R15.1 | 104.52,42.43 109.28,42.43 arc-90 109.6,42.12 109.6,41.02 arc-90 109.09,40.39 109.73,40.39 | 109.6,40.29 arc90 JP4.1 109.67,40.32 arc-90 109.73,40.39 | 109.73,40.39 110.11,40.39 | 110.11,40.39 110.24,40.39 | 110.11,40.39 arc-90 109.6,40.89
HALL2
  Top 0.254: U$2.52 46.31,20.1 arc-45 46.54,20.01 47.24,19.3 66.55,19.3 arc90 66.8,19.56 66.8,29.46 arc-90 68.2,30.86 91.18,30.86 arc45 91.41,30.95 97.7,37.24 arc-45 97.92,37.34 103.77,37.34 arc45 103.99,37.43 R14.1 105.6,37.45 arc90 105.92,37.77 105.92,38.92 arc-90 106.24,39.24 109.65,39.24 arc-90 JP4.2
HALL3
  Top 0.254: U$2.51 45.92,19.6 arc-45 46.15,19.51 46.86,18.8 67.06,18.8 arc90 67.44,19.18 67.44,29.08 arc-90 68.58,30.23 92.2,30.23 arc45 92.42,30.32 98.33,36.23 arc-45 98.56,36.32 103.57,36.32 arc-90 103.89,36.01 103.89,34.81 arc90 R13.1 106.24,34.8 arc90 106.55,35.12 106.55,37.91 arc-90 106.87,38.23 JP4.3
LED1
  Top 0.254: U$2.28 15.65,20.6 arc45 15.43,20.51 2.54,7.62 LED1.K
LED2  (via drill 0.6)
  Top 0.254: U$2.27 19.54,21.1 arc-45 19.32,21.2 v18.54,21.97 | v18.54,19.18 12.29,12.92 arc45 12.19,12.7 LED2.K
  Bottom 0.254: v18.54,19.18 v18.54,21.97
LED3  (via drill 0.6)
  Top 0.254: LED3.K 24.67,6.51 arc-45 24.9,6.6 29.71,6.6 arc45 29.94,6.7 v35.18,11.94 | U$2.45 38.19,15.21 arc-45 38.1,14.98 v37.34,14.22
  Bottom 0.254: v35.18,11.94 arc-45 35.27,12.15 36.89,13.78 v37.34,14.22
LED4  (via drill 0.6)
  Top 0.254: LED4.K 31.24,5.71 arc-45 31.34,5.93 v36.32,10.92 | U$2.46 38.69,13.8 arc-45 38.6,13.58 v38.48,13.46
  Bottom 0.254: v36.32,10.92 36.32,11.17 arc-45 36.41,11.4 37.85,12.83 v38.48,13.46
M2
  Top 0.254: U$1.12 55.94,50.64 arc90 56.26,50.96 56.26,52.26 arc90 55.94,52.58 54.48,52.58 arc-90 U$1.9 52.34,52.59 arc45 52.12,52.5 51.44,51.82 48.61,51.82 arc45 48.38,51.72 R2.1 arc90 48.17,51.69
  Top 0.508: C14.1 47.66,50.87 arc-45 47.76,51.1 R2.1 | R3.1 47.37,54.74 arc90 46.74,54.1 46.74,52.07 arc90 47.12,51.69 48.17,51.69
MCLR1  (via drill 0.6)
  Top 0.254: JP3.MCLR 44.58,7.36 arc45 44.48,7.59 v41.15,10.92 | 36.69,25.91 U$2.7 | R8.2 28.28,28.33 arc-45 28.5,28.81 RESET.1 30.68,27.74 arc45 30.77,27.52 33.02,25.27 36.31,25.27 arc-90 36.69,24.89 | v39.24,18.54 36.78,21 arc-45 36.69,21.23 36.69,24.89 | 36.69,24.89 36.69,25.91 | 36.69,25.91 arc-90 36.06,25.27
  Bottom 0.254: v41.15,10.92 41.15,16.51 arc45 41.05,16.73 v39.24,18.54
N$3
  Top 0.254: U$1.23 68.97,49.37 arc45 69.19,49.47 R6.1
N$4  (via drill 0.6)
  Top 0.254: U$1.30 73.64,53.92 arc45 73.87,54.02 C12.2
  Top 0.762: v77.22,54.61 77.02,54.41 arc-45 76.79,54.32 C12.2
  Top 1.524: 83.95,53.98 83.63,54.29 v82.93,54.99
  Bottom 1.524: v77.22,54.61 82.42,54.61 arc45 82.64,54.7 v82.93,54.99
  pour Top (no thermals): 92.71,53.09 93.6,53.09 arc-90 93.85,52.83 93.85,51.94 arc-90 93.6,51.69 91.31,51.69 arc90 90.93,51.31 90.93,50.04 arc-90 90.55,49.66 88.14,49.66 arc-45 87.92,49.75 84.58,53.09 82.93,53.09 arc-90 82.68,53.34 82.68,55.24 arc-90 83.06,55.63 90.68,55.63 arc-90 91.06,55.24 91.06,53.34 arc90 91.31,53.09
N$5
  Top 1.016: R1.1 81.06,65.91 arc90 C8.1
N$6
  Top 0.254: U$1.28 74.15,52.62 arc-45 C12.1
N$8  (via drill 0.6)
  Top 0.254: U$1.35 65.89,57.17 arc-45 65.67,57.27 v64.52,58.42 | v70.36,62.23 73.06,62.23 arc-45 C11.1
  Bottom 0.254: v64.52,58.42 66.42,58.42 arc45 66.64,58.51 v70.36,62.23
N$9  (via drill 0.6)
  Top 0.254: U$1.22 69.8,48.72 arc45 70.03,48.82 70.65,49.44 arc-45 70.87,49.53 73.95,49.53 arc-45 C13.2
  Top 0.762: v78.99,46.48 76.08,49.4 arc45 75.85,49.49 C13.2
  Top 1.016: 84.62,48.17 arc-45 84.84,48.26
  Top 1.524: v82.93,46.48 84.62,48.17
  Bottom 1.524: v78.99,46.48 v82.93,46.48
  pour Top (no thermals): 92.84,49.02 93.47,49.02 arc-90 93.73,48.77 93.73,47.75 arc-90 93.47,47.5 91.31,47.5 arc90 90.93,47.12 90.93,45.72 arc-90 90.81,45.59 82.68,45.59 arc-90 82.42,45.85 82.42,50.67 arc-90 82.55,50.8 85.34,50.8 arc-90 85.47,50.67 87.16,48.99 arc45 87.38,48.9 91.19,48.9
N$10  (via drill 0.6)
  Top 0.254: U$1.20 68.9,47.42 arc-45 69.13,47.33 v69.72,46.74 | v73.91,45.85 73.91,47.53 arc-45 74.01,47.76 C13.1
  Bottom 0.254: v69.72,46.74 72.89,46.74 arc-45 73.12,46.64 v73.91,45.85
N$11  (via drill 0.6)
  Top 0.254: U$1.33 68.95,55.87 arc45 69.17,55.97 70.23,57.02 | 72.73,60.2 arc45 72.95,60.29 C11.2
  Top 0.508: 70.23,57.02 70.23,59.18 arc-45 70.32,59.4 71.12,60.2 72.73,60.2
  Top 0.762: v76.07,61.85 75.7,61.85 arc45 75.47,61.76 74.3,60.58 arc-45 74.08,60.49 C11.2
  Top 1.524: v82.42,62.74 82.8,62.74 83.57,61.98
  Bottom 1.524: v76.07,61.85 81.4,61.85 arc45 81.63,61.94 v82.42,62.74
  pour Top (no thermals): 93.22,57.91 93.73,57.91 arc-90 93.85,57.78 93.85,56.64 arc-90 93.6,56.39 84.07,56.39 arc-90 83.31,57.15 83.31,61.21 arc90 82.8,61.72 82.68,61.72 arc-90 82.3,62.1 82.3,62.99 arc-90 82.8,63.5 90.3,63.5 arc-90 90.81,62.99 90.81,58.42 arc90 91.44,57.78 92.33,57.78 arc90 92.46,57.91
N$12
  Top 0.254: U$1.7 53.43,53.89 arc-45 53.2,53.99 52.32,54.86 51.53,54.86 arc45 51.3,54.77 R3.2
N$13
  Top 0.254: U$1.32 69.61,55.22 arc45 69.83,55.32 R4.1
N$14
  Top 0.254: U$1.31 71.59,54.57 arc45 71.81,54.67 | 74.97,55.63 arc45 75.19,55.72
  Top 0.508: 71.81,54.67 72.77,55.63 74.97,55.63 | 75.19,55.72 R5.1
N$15
  Top 0.254: U$2.56 43.43,22.1 arc45 43.66,22.2 44.32,22.86 49.28,22.86 arc-90 49.66,22.48 49.66,22.1 arc90 49.91,21.84 C16.+
N$20
  Top 0.762: R9.1 91.37,20.95 arc45 91.6,21.05 XLED4.AN
N$21
  Top 0.762: R10.2 93.58,8.76 arc45 XLED1.AN
N$22
  Top 0.762: R11.2 94.93,11.05 arc-45 95.15,10.96 XLED3.AN
N$23
  Top 0.762: R12.2 90.89,16.15 arc-45 90.99,16.37 XLED2.AN
N$24  (via drill 0.6)
  Top 0.762: R9.2 80.78,20.99 arc45 80.55,21.08 v79.12,21.08
  Bottom 0.762: v79.12,21.08 v79.12,21.08 arc45 79.22,21.31 XBEE.6
N$25
  Top 0.762: R10.1 89.19,4.93 arc45 XBEE.20
N$26  (via drill 0.6)
  Top 0.762: R11.1 85.47,11.05 arc45 85.25,10.96 v83.06,8.76
  Bottom 0.762: v83.06,8.76 arc-45 83.03,8.69 XBEE.15
N$27  (via drill 0.6)
  Top 0.762: R12.1 83.83,13.46 arc45 83.6,13.37 v81.92,11.68
  Bottom 0.762: v81.92,11.68 arc-45 81.84,11.5 XBEE.13
N$29
  Top 0.508: R16.1 5.93,4.66 arc90 LED1.A
N$31
  Top 0.508: R17.1 15.58,4.66 arc90 LED2.A
N$32
  Top 0.508: R18.1 25.36,4.66 arc90 LED3.A
N$33
  Top 0.508: R19.1 34.63,4.66 arc90 LED4.A
OUT_A
  pour Top (no thermals): 95,57.78 96.17,58.96 arc-45 96.4,59.05 99.82,59.05 99.82,55.37 96.14,55.37 arc-45 95.92,55.47 95,56.52
  pour Top (no thermals): 98.55,58.55 arc-90 101.09,58.55 arc-90 101.09,55.88 arc-90 98.55,56.01 arc-90
OUT_B
  pour Top (no thermals): 94.87,52.58 96.81,54.64 arc-45 97.03,54.74 99.82,54.74 99.82,51.05 95.89,51.05 arc-45 95.67,51.15 95,51.56
  pour Top (no thermals): 98.55,54.23 arc-90 101.09,54.23 arc-90 101.09,51.56 arc-90 98.55,51.69 arc-90
OUT_C
  pour Top (no thermals): 95,48.9 96.17,50.33 arc-45 96.4,50.42 99.82,50.42 99.82,46.74 95.76,46.74 arc-45 95.54,46.83 95,47.75
  pour Top (no thermals): 98.55,49.91 arc-90 101.09,49.91 arc-90 101.09,47.24 arc-90 98.55,47.37 arc-90
PGEC2
  Top 0.254: U$2.48 39.69,15.55 arc90 40.01,15.24 51.94,15.24 arc-90 52.7,14.48 52.7,9.02 arc90 53.21,8.51 54.48,8.51 arc-90 54.86,8.13 54.86,6.99 arc-90 JP3.PGEC
PGED2
  Top 0.254: U$2.47 39.19,15.16 arc90 39.62,14.73 51.31,14.73 arc-90 52.07,13.97 52.07,6.99 arc90 JP3.PGED
PWM1H  (via drill 0.6)
  Top 0.254: U$2.61 46.7,24.6 arc90 47.5,25.4 U$34.4 47.5,31.69 arc-90 47.82,32 51.18,32 arc45 51.4,32.1 v56.26,36.96 | U$1.4 62.14,55.84 arc-90 62.61,55.37 v62.61,49.66
  Bottom 0.254: v56.26,36.96 59.22,39.91 arc45 59.31,40.14 59.31,42.8 61.21,44.7 61.5,44.99 62.52,46.01 arc45 62.61,46.23 v62.61,49.66
PWM1L
  Top 0.254: U$2.60 47.34,24.1 arc90 48.13,24.89 48.13,29.95 arc-90 U$34.5
PWM2H  (via drill 0.6)
  Top 0.254: U$2.63 45.03,25.6 arc90 45.59,26.16 45.59,29.92 arc90 U$34.1 45.55,33.1 arc-90 45.72,33.27 50.55,33.27 55.41,38.13 arc45 55.5,38.36 v55.5,41.02 | U$1.6 59.76,54.54 arc-90 59.94,54.36 v59.94,50.55
  Bottom 0.254: v55.5,41.02 57.4,41.02 arc45 57.62,41.11 57.91,41.4 57.91,43.3 arc-45 58.01,43.53 59.85,45.37 arc45 59.94,45.6 59.94,48.64 v59.94,50.55
PWM2L
  Top 0.254: U$2.62 45.68,25.1 arc90 46.23,25.65 46.23,29.94 arc90 U$34.2
PWM3H  (via drill 0.6)
  Top 0.254: U$1.16 55.97,48.04 arc-45 56.19,47.95 v56.52,47.75 | U$2.1 39.69,33.34 arc-45 39.78,33.56 43.72,37.5 arc-45 43.95,37.59 48.51,37.59 arc-90 48.8,37.31 U$34.9 48.8,37.87 arc-45 48.89,38.1 v55.37,44.58
  Bottom 0.254: v56.52,47.75 56.52,45.34 55.75,44.58 v55.37,44.58
PWM3L
  Top 0.254: U$34.10 48.15,36.77 arc90 47.83,37.08 44.33,37.08 arc45 44.1,36.99 40.35,33.24 arc45 40.26,33.02 40.26,30.23 arc45 40.35,30.01 41.56,28.8 arc-45 41.66,28.57 41.64,26.59 arc-90 41.07,26.11 41.62,26.1 | 41.66,26.14 arc-45 U$2.64 41.62,26.1 arc90 41.62,26.1 | 41.62,26.1 42.2,26.09 | 42.2,26.09 42.27,26.1 | 42.2,26.09 arc-90 41.64,26.77
RES_A  (via drill 0.6)
  Top 0.254: U$34.6 48.8,31.18 arc-90 49.12,31.5 52.19,31.5 arc45 52.42,31.59 57.56,36.74 arc45 57.66,36.96 57.66,39.62 arc-45 57.75,39.84 v58.42,40.51 | U$1.5 60.63,55.19 arc-90 61.09,54.74 v61.09,52.2
  Bottom 0.254: v58.42,40.51 58.42,42.79 arc-45 58.51,43.02 60.99,45.5 arc45 61.09,45.72 v61.09,52.2
RES_B  (via drill 0.6)
  Top 0.254: U$34.3 46.85,32.32 arc-90 47.17,32.64 50.67,32.64 56.55,38.52 arc45 56.64,38.74 v56.64,42.67 | U$1.14 58.48,49.34 arc-45 58.7,49.25 v58.93,49.02
  Bottom 0.254: v58.93,49.02 58.93,45.72 arc-45 58.84,45.5 56.73,43.4 arc45 56.64,43.17 v56.64,42.67
RES_C  (via drill 0.6)
  Top 0.254: U$1.15 57.22,48.69 arc-45 57.45,48.6 v57.78,48.26 | U$34.8 49.45,36.87 arc-45 49.54,37.09 v52.83,40.39
  Bottom 0.254: v57.78,48.26 57.78,45.6 arc-45 57.69,45.37 54.1,41.78 53.59,41.27 52.92,40.6 arc45 v52.83,40.39
RTS  (via drill 0.6)
  Top 0.254: XBEE.16 81.22,9.21 arc90 80.52,9.91 54.36,9.91 arc-90 53.85,10.41 53.85,15.37 arc90 52.45,16.76 44.96,16.76 arc-45 44.74,16.86 v44.45,17.14 | U$2.55 43.95,21.6 arc45 44.17,21.7 44.83,22.35 48.77,22.35 arc-90 49.15,21.97 v49.15,20.7
  Bottom 0.254: v44.45,17.14 45.46,17.14 arc45 45.69,17.24 v49.15,20.7
RX
  Top 0.254: U$2.50 45.54,19.1 arc-45 45.76,19.01 46.61,18.16 67.56,18.16 arc90 68.07,18.67 68.07,28.57 arc-90 68.96,29.46 84.5,29.46 arc-45 84.72,29.37 XBEE.2
TX
  Top 0.254: U$2.49 45.02,18.6 arc-45 45.24,18.51 46.35,17.4 68.33,17.4 arc90 68.71,17.78 68.71,28.19 arc-90 69.09,28.57 83.38,28.57 arc-45 83.61,28.48 XBEE.3
USER  (via drill 0.6)
  Top 0.254: U$2.44 37.69,18.06 arc45 37.6,18.28 v36.96,18.92
  Top 0.508: USER.2 33.09,12.06 arc-45 33,11.83 R7.1
  Bottom 0.254: USER.2 33.09,14.93 arc-45 33.19,15.15 v36.96,18.92
VREG
  Top 0.254: 54.35,50.04 arc-45 U$1.13 arc45 54.35,50.04 | 52.58,50.04 54.35,50.04 | U$1.11 53.07,51.29 arc90 52.58,50.8 | 52.58,50.04 52.58,50.8 | U$1.10 52.7,51.94 arc90 52.58,51.82 52.58,50.8 | 52.58,50.04 49.62,50.04 arc45 49.4,49.95 C14.2

### Text on the board
tPlace: 1000uF | Motor | 2940 | Capacitors | + | GND | 24V | 3.3 | 1uF | 10nF | 100nF | 100nF | .1uF | 3 | 2 | 1 | 10uF | DRV8332 | CC6-240S5F-E | + | 1uF | 10m | 1 | 330uF | 10m | 100nF | Motor | 20k | 100nF | 1 | 2 | 100nF | 100nF | 1uF | 10m | 47uF | + | 3 | 1uF | 100nF | Encoder | 4 | 5 | 6 | 7 | Motor | 1k | 1 | 2 | 1k | 3 | _ | SN74LV | + | 2.2k | RESET | .1uF | 1k | 1117 | .01uF | .01uF | .1uF | .1uF | 10uF | .1uF | RSSI | 10uF | .1uF | .01uF | SLEEP | 10uF | 1k | 1k | XBee | .01uF | 1k | USER | .1uF | 1 | 2 | 3 | 1k | ASSOC | 4 | 2.2k | ON/OFF | 1k | 1k | 1k | 1k